# Altium schematic sheet [04] - Current Transformers.SchDoc
size A3
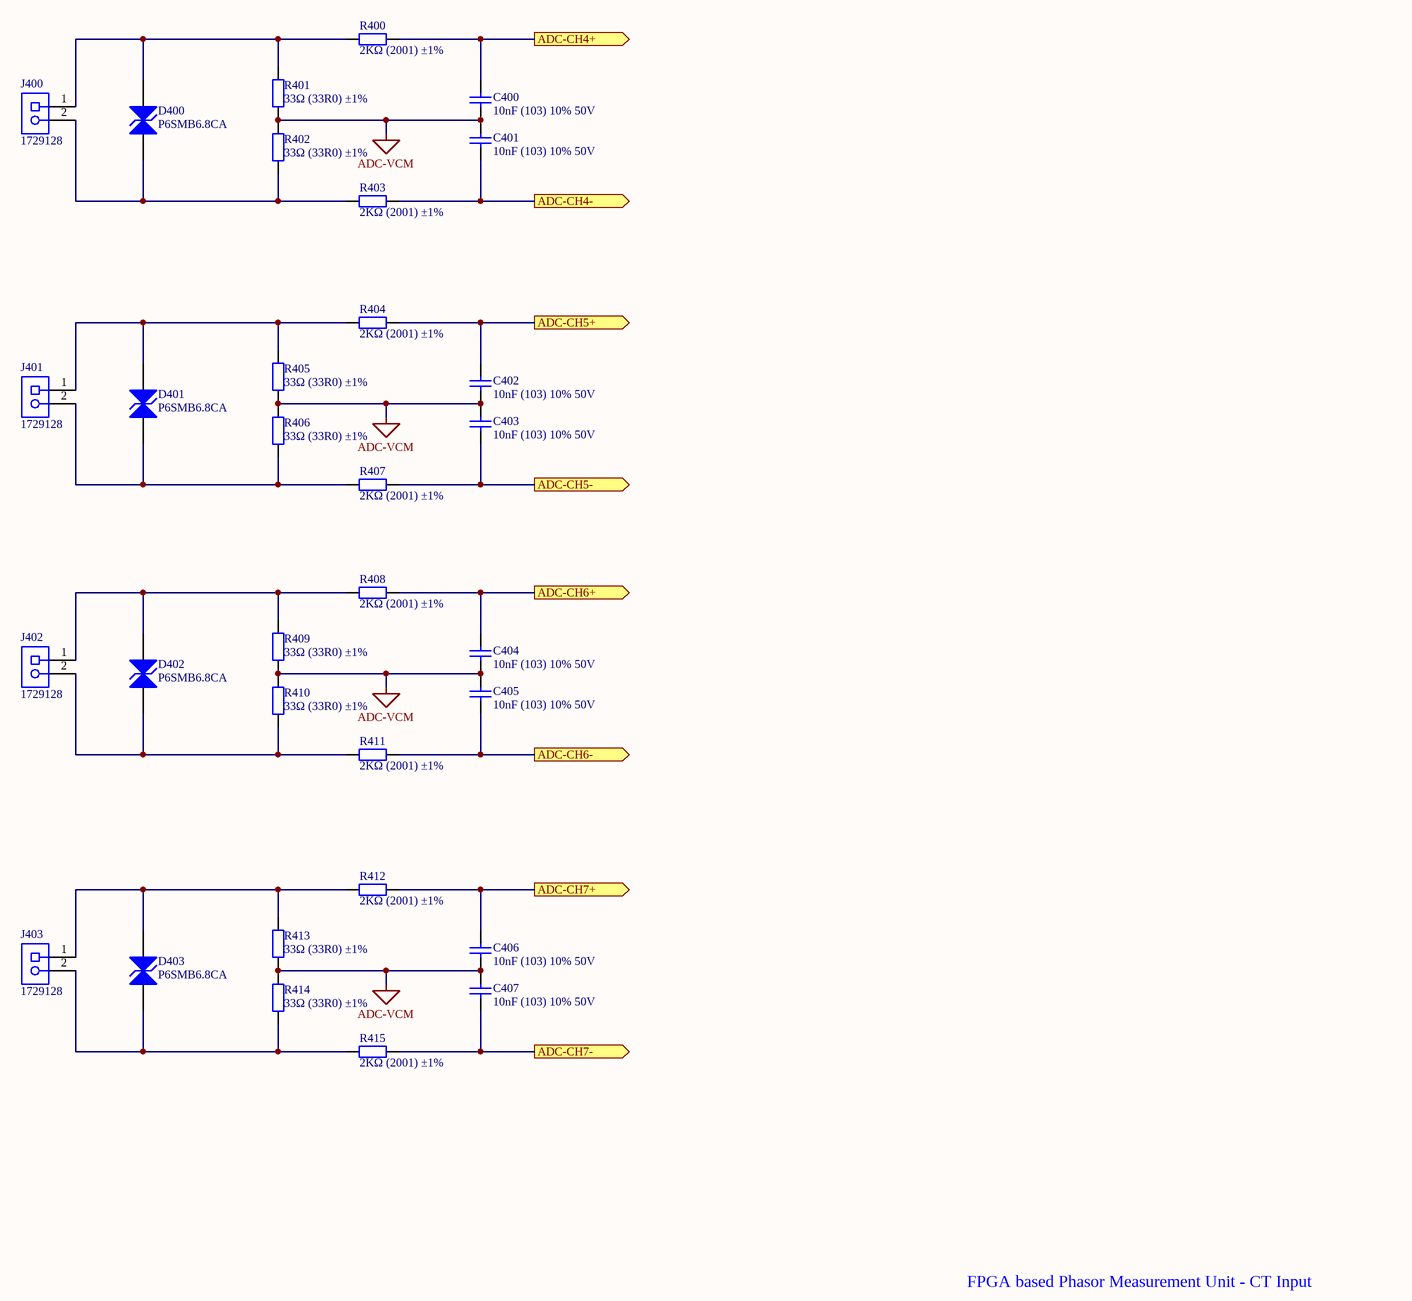
[diagram p0: [04] - Current Transformers.SchDoc]

## Parts
C400  10nF (103) 10% 50V  [0805_C]
C401  10nF (103) 10% 50V  [0805_C]
C402  10nF (103) 10% 50V  [0805_C]
C403  10nF (103) 10% 50V  [0805_C]
C404  10nF (103) 10% 50V  [0805_C]
C405  10nF (103) 10% 50V  [0805_C]
C406  10nF (103) 10% 50V  [0805_C]
C407  10nF (103) 10% 50V  [0805_C]
D400  P6SMB6.8CA  [SMB(DO-214AA)_S1]
D401  P6SMB6.8CA  [SMB(DO-214AA)_S1]
D402  P6SMB6.8CA  [SMB(DO-214AA)_S1]
D403  P6SMB6.8CA  [SMB(DO-214AA)_S1]
J400  1729128  [PHOE-1729128-2_V]
J401  1729128  [PHOE-1729128-2_V]
J402  1729128  [PHOE-1729128-2_V]
J403  1729128  [PHOE-1729128-2_V]
R400  2KΩ (2001) ±1%  [0805_R]
R401  33Ω (33R0) ±1%  [0603_R]
R402  33Ω (33R0) ±1%  [0603_R]
R403  2KΩ (2001) ±1%  [0805_R]
R404  2KΩ (2001) ±1%  [0805_R]
R405  33Ω (33R0) ±1%  [0603_R]
R406  33Ω (33R0) ±1%  [0603_R]
R407  2KΩ (2001) ±1%  [0805_R]
R408  2KΩ (2001) ±1%  [0805_R]
R409  33Ω (33R0) ±1%  [0603_R]
R410  33Ω (33R0) ±1%  [0603_R]
R411  2KΩ (2001) ±1%  [0805_R]
R412  2KΩ (2001) ±1%  [0805_R]
R413  33Ω (33R0) ±1%  [0603_R]
R414  33Ω (33R0) ±1%  [0603_R]
R415  2KΩ (2001) ±1%  [0805_R]

## Ports
ADC-CH4+ (out), ADC-CH4- (out), ADC-CH5+ (out), ADC-CH5- (out), ADC-CH6+ (out), ADC-CH6- (out), ADC-CH7+ (out), ADC-CH7- (out)

## Nets
ADC-VCM: C400.1 C401.2 C402.1 C403.2 C404.1 C405.2 C406.1 C407.2 R401.1 R402.2 R405.1 R406.2 R409.1 R410.2 R413.1 R414.2
ADC-CH4+: C400.2 R400.1 ; port ADC-CH4+
ADC-CH4-: C401.1 R403.1 ; port ADC-CH4-
ADC-CH5+: C402.2 R404.1 ; port ADC-CH5+
ADC-CH5-: C403.1 R407.1 ; port ADC-CH5-
ADC-CH6+: C404.2 R408.1 ; port ADC-CH6+
ADC-CH6-: C405.1 R411.1 ; port ADC-CH6-
ADC-CH7+: C406.2 R412.1 ; port ADC-CH7+
ADC-CH7-: C407.1 R415.1 ; port ADC-CH7-
NetD400_1: D400.1(A) J400.2 R402.1 R403.2
NetD400_2: D400.2(K) J400.1 R400.2 R401.2
NetD401_1: D401.1(A) J401.2 R406.1 R407.2
NetD401_2: D401.2(K) J401.1 R404.2 R405.2
NetD402_1: D402.1(A) J402.2 R410.1 R411.2
NetD402_2: D402.2(K) J402.1 R408.2 R409.2
NetD403_1: D403.1(A) J403.2 R414.1 R415.2
NetD403_2: D403.2(K) J403.1 R412.2 R413.2

## Notes on the sheet
- FPGA based Phasor Measurement Unit - CT Input

## Library data of the parts
C400-C407 = 0805 10nF (103) 10% 50V: 贴片电容; ComponentLink1Description: 供应商链接; ComponentLink1URL: http://www.szlcsc.com/product/details_2062.html; Package: 0805; Supplier: LC; SuppliersPartNumber: C1710
D400-D403 = SMB/DO-214AA P6SMB6.8CA: TVS; ComponentLink1Description: 供应商链接; ComponentLink1URL: http://www.szlcsc.com/product/details_79530.html; Package: SMB/DO-214AA; Supplier: LC; SuppliersPartNumber: C78395
J400-J403 = CMP-2000-05815-1: PCB Terminal Block, 13.5 A, 400 V, 2-Pin THD, RoHS, Bulk; Manufacturer: Phoenix Contact; Package Version: 03/2015; No. of Rows: 1; Pitch: 5.08mm; No. of Positions: 2; Voltage Rating: 400V; Current Rating: 13500mA; Manufacturer URL: http://www.phoenixcontact.com/; Datasheet URL: https://datasheet.ciiva.com/16046/1729128-16046181.pdf; RoHS: TRUE; Package URL: https://www.phoenixcontact.com/online/portal/pi/pxc/product_detail_page/!ut/p/b1/3VdJjqNKFDxLH8AFycySyWY2ozFsEPOMMQaDOX1XedGL_1Vdm5YXJleknhSKeBkvI6EA8ncAo3AYoDhBQGco6KN7VURTdemj9us_IEKEZo_YHiPAEWEFmDGOHMORkqKYCORBZxgL7ZoaZYcbFFUZ3fqxSY6GOuxydWUuHqz1ynmMFygu583Bob0Ewr6Sd_l-5m-kAueHiB0jpRwZwe58wwtkpxtMYd_LmGcDRU02dRNEyWt6Y2ti5pSyJ_reIkzIulrqApdnbT11V5jnCKbYNCvhEM1MCpPByat_X379-iThf08CI5GfOPqfBeS3BRoBOdD55AKVv0iLwCMq-2BrzXWSGRH7pUGD9uwXQjiph3xL0DKQwdGa0JImiIOmBNOestqgwTHSSs2oOep-78apyXQBvNi8ZLaFjvjWvcaUEBu0MC6Wbe-d6mB0FAebo2lUWinqYaZs5DAYzV0RP9yitUjnGJ0iI9xhZkT42OCQNUJJhkgWINNQLP2JFP6OpMg3JCVg70jqHT0lvKOnhHf0lPuOnnLf0VPuWx6_dxwUIvwk5WMkT0kLL1mh61l2yZVSzG3pYV_bqo-mj6uMKwKwdnnW8Jh5RTOJzMOA5c-eJDaZQw4mTMPH02PvS_ZAqNVjVTo2WyYLkwH_KU1mmmG5kjRhDqPXLwwVHvVOjCM60-fpXvTDfMGW1PVFVS1r4e4yVDk4ZdNbkUHvqPqQSeian4UD39fNKmachqdJ1NJbyk8rXT9mXTvPk3oE5meulKGgiruPJek-4I9hTT6G8ZLOyRSm2RRVbThERQad5OS28hdt4YW4vG0stgYYzsWsK4_7y6DZMjJSCqri1kyiZR5vD7pwIrNR7QwPHTcLTI5qT7eRlpHrdGiupYlqQDJ7zy_CND8fWWBoLRXxk1RVcXiBQwbTD4Xi7KL-FuO94t9xaqweXzH; PartNumber: 1729128; Package Description: 2-Pin Through Hole Device, Body 8.1 x 10.16 mm, Pitch 5.08 mm; Datasheet Version: 12/2013; Mounting Technology: ThroughHole; Orientation: Horizontal; Package Reference: 1729128-2; Packing: Bulk; JLCPCB: NO
R400 R403 R404 R407 R408 R411 R412 R415 = 0805 2KΩ (2001) 1%: 贴片电阻; ComponentLink1Description: 供应商链接; ComponentLink1URL: http://www.szlcsc.com/product/details_18292.html; Package: 0805; Supplier: LC; SuppliersPartNumber: C17604
R401 R402 R405 R406 R409 R410 R413 R414 = 0603 33Ω (33R0) 1%: 贴片电阻; ComponentLink1Description: 供应商链接; ComponentLink1URL: http://www.szlcsc.com/product/details_23867.html; Package: 0603; Supplier: LC; SuppliersPartNumber: C23140